# EAGLE design Arduino_S3v3_R3_ftdi (EAGLE 6.2)
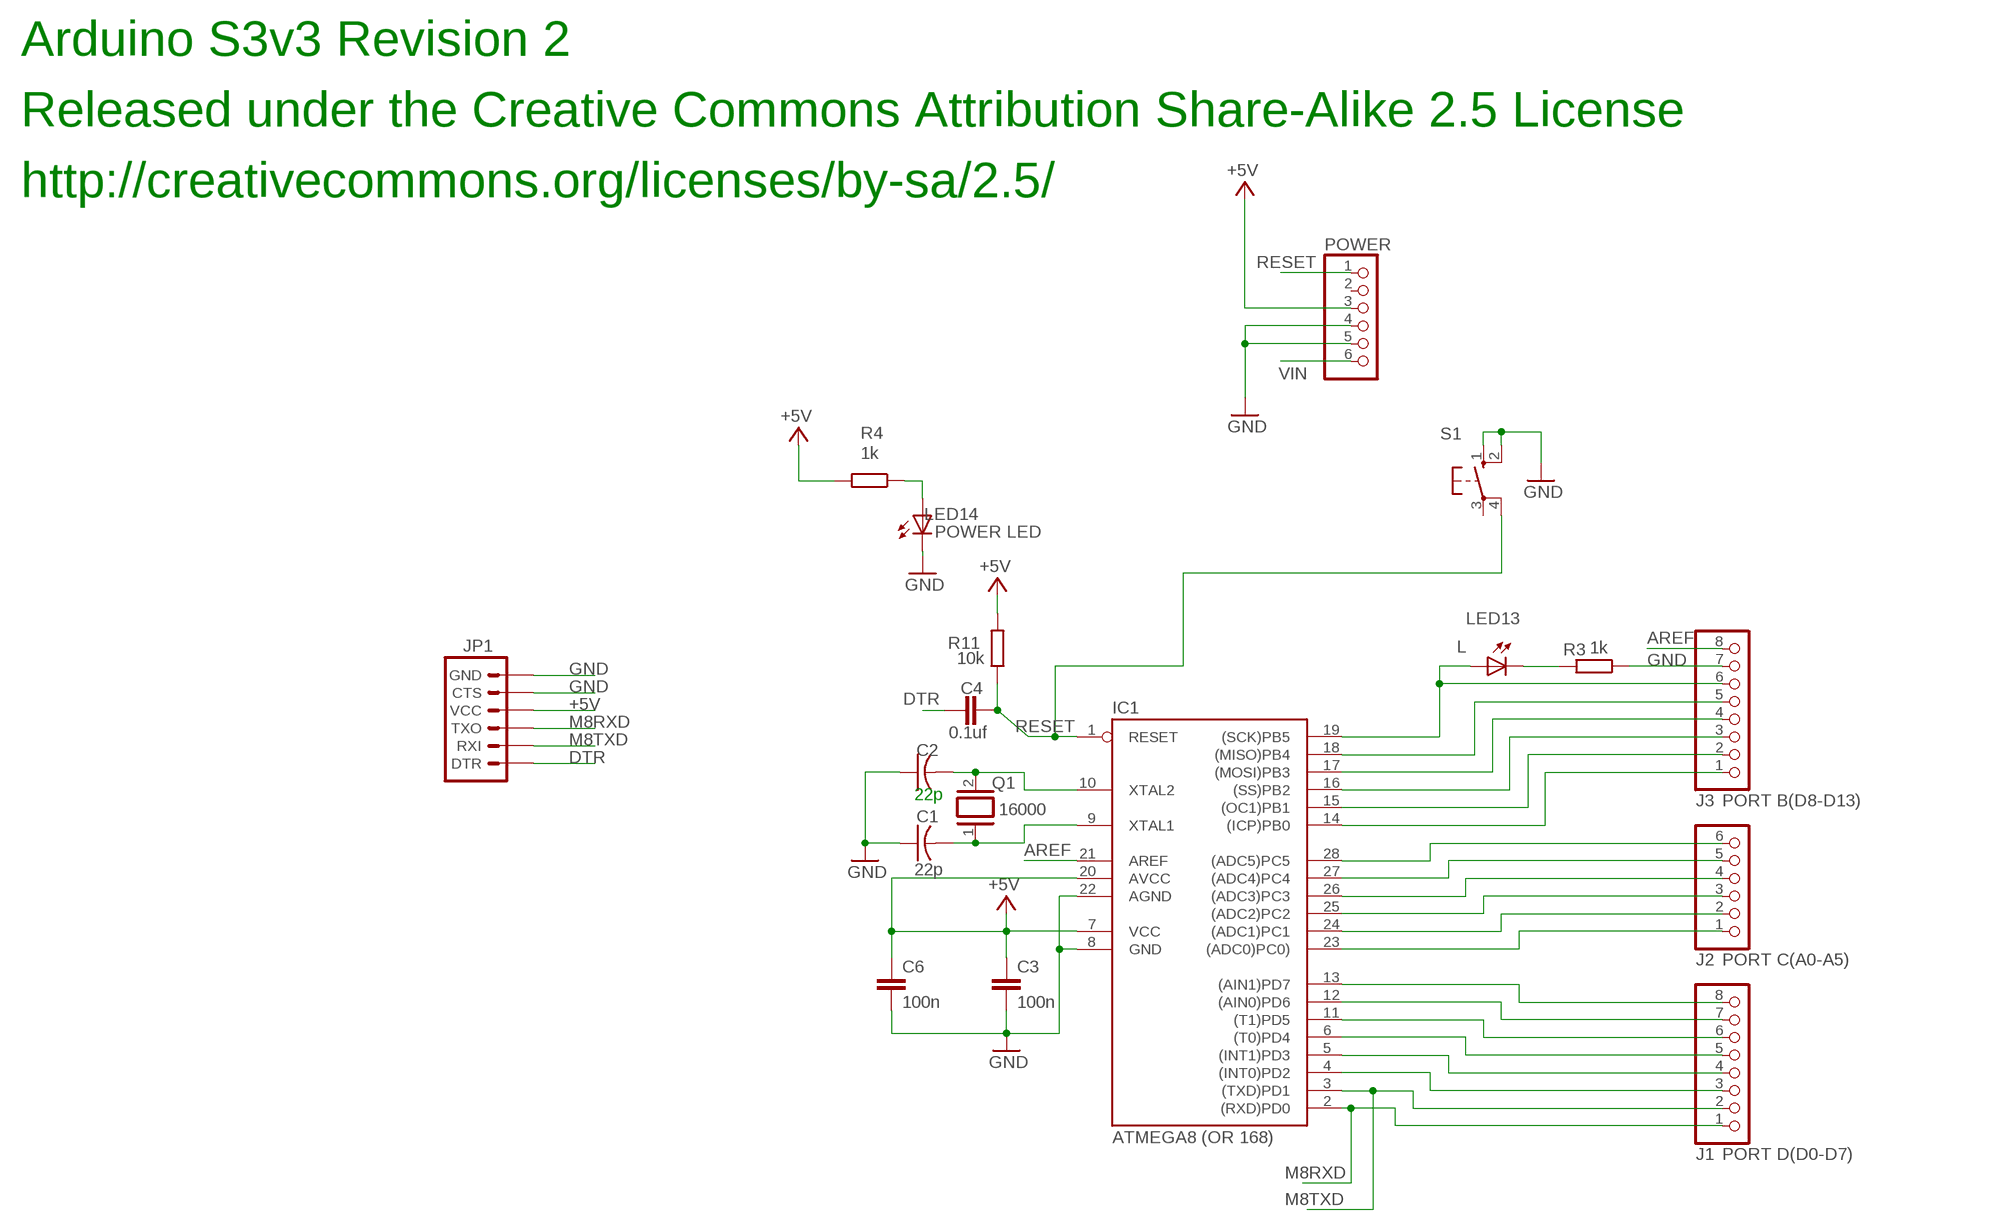
[diagram p0: schematic, sheet 1]

## Parts
C1  22p  C-US025-024X044  [C025-024X044]
C2  22p  C-US025-024X044  [C025-024X044]
C3  100n  C-EU050-025X075  [C050-025X075]
C4  0.1uf  C-EU050-025X075  [C050-025X075]
C6  100n  C-EU050-025X075  [C050-025X075]
IC1  ATMEGA8 (OR 168)  AT90S4433P  [DIL28-3]
J1  PORT D(D0-D7)  PINHD-1X8  [1X08]
J2  PORT C(A0-A5)  PINHD-1X6  [1X06]
J3  PORT B(D8-D13)  PINHD-1X8  [1X08]
JP1  ARDUINO_SERIAL_PROGRAMLONGPADS  [1X06_LONGPADS]
LED13  L  LED3MM  [LED3MM]
LED14  POWER LED  LED3MM  [LED3MM]
POWER  PINHD-1X6  [1X06]
Q1  16000  XTAL/S  [QS]
R3  1k  R-EU_0207/10  [0207/10]
R4  1k  R-EU_0207/10  [0207/10]
R11  10k  R-EU_0207/10  [0207/10]
S1  10-XX  [B3F-10XX]

## Nets
+5V [power]: C3.1 C6.1 IC1.7(VCC) IC1.20(AVCC) JP1.4(VCC) POWER.3 R4.2 R11.2
AREF: IC1.21(AREF) J3.8
DTR: C4.1 JP1.1(DTR)
GND: C1.1 C2.1 C3.2 C6.2 IC1.8(GND) IC1.22(AGND) J3.7 JP1.5(CTS) JP1.6(GND) LED14.K(C) POWER.4 POWER.5 R3.1 S1.1(S) S1.2(S1)
M8RXD: IC1.2((RXD)PD0) J1.1 JP1.3(TXO)
M8TXD: IC1.3((TXD)PD1) J1.2 JP1.2(RXI)
N$1: IC1.18((MISO)PB4) J3.5
N$3: LED14.A R4.1
N$4: IC1.17((MOSI)PB3) J3.4
N$5: IC1.14((ICP)PB0) J3.1
N$6: C1.2 IC1.9(XTAL1) Q1.1
N$7: C2.2 IC1.10(XTAL2) Q1.2
N$10: IC1.4((INT0)PD2) J1.3
N$11: IC1.5((INT1)PD3) J1.4
N$12: IC1.6((T0)PD4) J1.5
N$13: IC1.11((T1)PD5) J1.6
N$14: IC1.12((AIN0)PD6) J1.7
N$15: IC1.13((AIN1)PD7) J1.8
N$16: IC1.23((ADC0)PC0)) J2.1
N$17: IC1.24((ADC1)PC1) J2.2
N$18: IC1.25((ADC2)PC2) J2.3
N$19: IC1.26((ADC3)PC3) J2.4
N$20: IC1.27((ADC4)PC4) J2.5
N$21: IC1.28((ADC5)PC5) J2.6
N$22: IC1.15((OC1)PB1) J3.2
N$23: IC1.16((SS)PB2) J3.3
N$31: LED13.K(C) R3.2
RESET: C4.2 IC1.1(RESET) POWER.1 R11.1 S1.4(P1)
SCK: IC1.19((SCK)PB5) J3.6 LED13.A
VIN [power]: POWER.6
Unconnected: POWER.2 S1.3(P)

## Notes on the sheet
- Arduino S3v3 Revision 2
- Released under the Creative Commons Attribution Share-Alike 2.5 License
- http://creativecommons.org/licenses/by-sa/2.5/

## Library data of the parts
C1 C2 = adafruit:C-US: CAPACITOR, American symbol
C3 C4 C6 = rcl:C-EU: CAPACITOR, European symbol
IC1 = atmel:AT90S4433: MICROCONTROLLER 4 Kbytes FLASH 128 bytes SRAM 256 bytes EEPROM UART 6-channel 10 bit ADC
J1 J3 = pinhead:PINHD-1X8: PIN HEADER
J2 POWER = pinhead:PINHD-1X6: PIN HEADER
JP1 = SparkFun:ARDUINO_SERIAL_PROGRAM
LED13 LED14 = led:LED: LED OSRAM: - CHIPLED LG R971, LG N971, LY N971, LG Q971, LY Q971, LO R971, LY R971 LH N974, LH R974 LS Q976, LO Q976, LY Q976 LO Q996 - Hyper CHIPLED LW Q18S LB Q993, LB Q99A, LB R99A - SideLED LS A670, LO A670, LY A670, LG A670, LP A670 LB A673, LV A673, LT A673, LW A673 LH A674 LY A675 LS A676, LA A676, LO A676, LY A676, LW A676 LS A679, LY A679, LG A679 - Hyper Micro SIDELED® LS Y876, LA Y876, LO Y876, LY Y876 LT Y87S - SmartLED LW L88C, LW L88S LB L89C, LB L89S, LG L890 LS L89K, LO L89K, LY L89K LS L896, LA L896, LO L896, LY L896 - TOPLED LS T670, LO T670, LY T670, LG T670, LP T670 LSG T670, LSP T670, LSY T670, LOP T670, LYG T670 LG T671, LOG T671, LSG T671 LB T673, LV T673, LT T673, LW T673 LH T674 LS T676, LA T676, LO T676, LY T676, LB T676, LH T676, LSB T676, LW T676 LB T67C, LV T67C, LT T67C, LS T67K, LO T67K, LY T67K, LW E67C LS E67B, LA E67B, LO E67B, LY E67B, LB E67C, LV E67C, LT E67C LW T67C LS T679, LY T679, LG T679 LS T770, LO T770, LY T770, LG T770, LP T770 LB T773, LV T773, LT T773, LW T773 LH T774 LS E675, LA E675, LY E675, LS T675 LS T776, LA T776, LO T776, LY T776, LB T776 LHGB T686 LT T68C, LB T68C - Hyper Mini TOPLED® LB M676 - Mini TOPLED Santana® LG M470 LS M47K, LO M47K, LY M47K Source: http://www.osram.convergy.de/
Q1 = special:XTAL/S: CRYSTAL
R3 R4 R11 = rcl:R-EU_: RESISTOR, European symbol
S1 = switch-omron:10-XX: OMRON SWITCH

## Net classes
1 power: width 0.61 mm

## Board
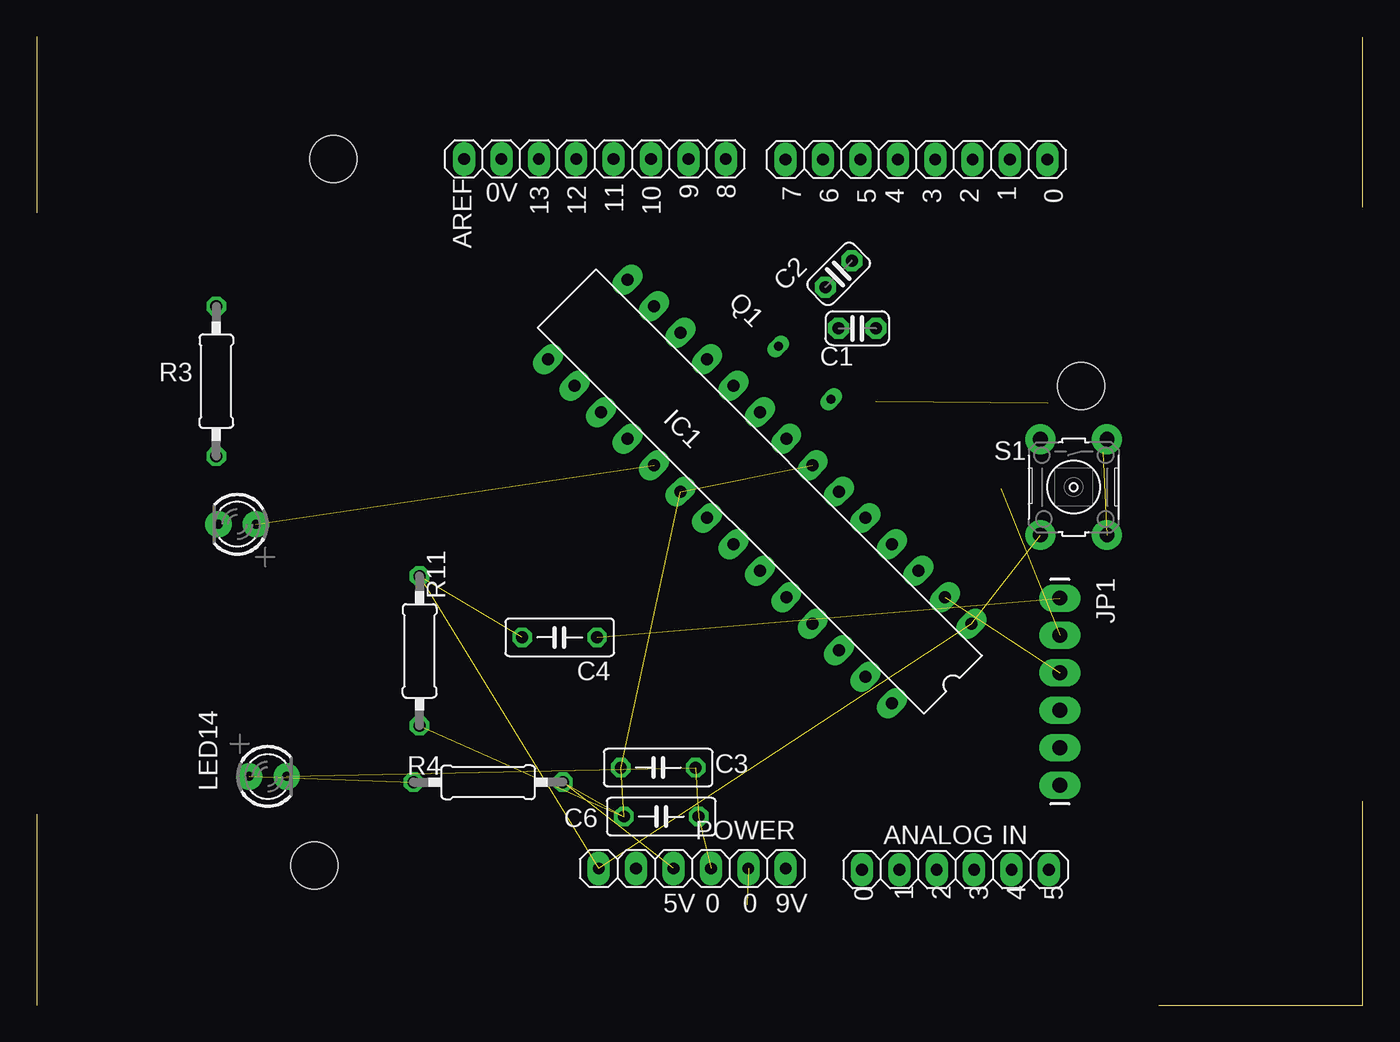
[diagram p1: board, top side]
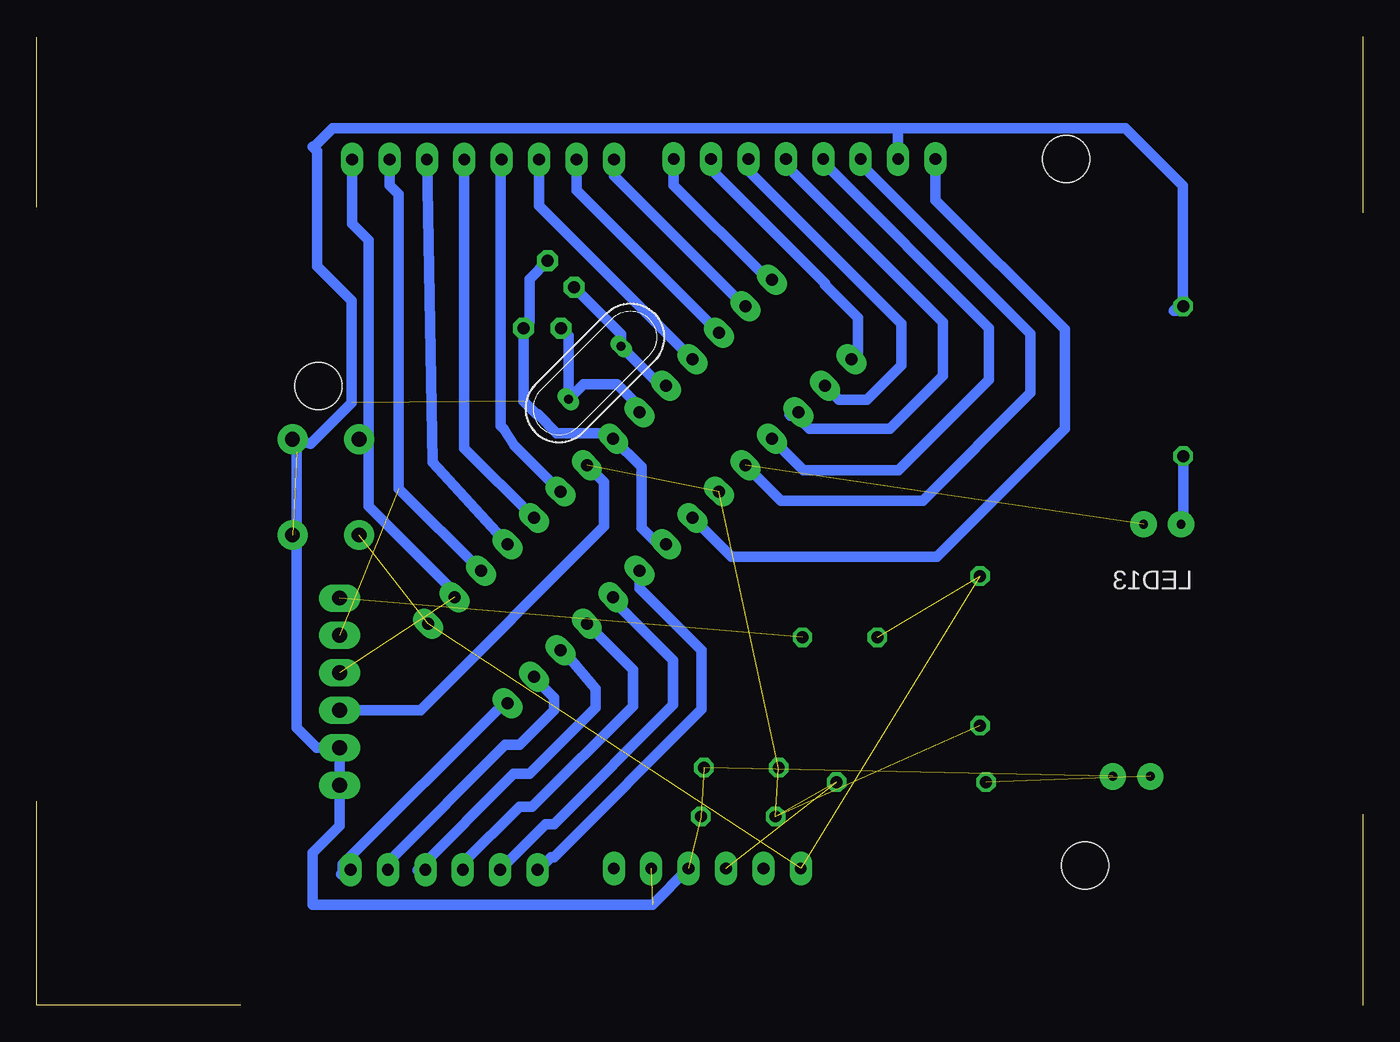
[diagram p2: board, bottom side, seen from below]

Size 90.05 x 65.74 mm. Coordinates in mm from the lower left corner, seen from the top.
Outline: 0,65.74 0,53.8
Outline: 0,12.95 0,0
Outline: 76.2,0 90.05,0
Outline: 90.05,0.01 90.05,13.85
Outline: 90.05,54.18 90.05,65.73
Copper layers (1*16): Top 0.035mm / dielectric 1.5mm / Bottom 0.035mm
Design rules: minimum track width 0.6mm, minimum drill 0.6mm, track to track 0.67mm, track to pad 0.67mm, pad to pad 0.67mm, via to via 0.67mm, smd to smd 0mil, copper to edge 0mil, drill to drill 8mil, minimum pad ring 10mil, minimum via ring 8mil, stop-mask expansion 0mil, vias tented up to drill 0mil, thermal gap 10mil
Holes 3.2 mm at 18.86,9.49 70.93,42.03 20.13,57.43

### Footprints (pad centres in the part's own frame; a part is rotated, then mirrored left to right if it is on the bottom)
C025-024X044 = drill 0.813 pad 1.422 octagon: 1 -1.27,0; 2 1.27,0
C050-025X075 = drill 0.813 octagon: 1 -2.54,0; 2 2.54,0
DIL28-3 = drill 0.813 pad 1.524 long: 1 -16.51,-3.81; 2 -13.97,-3.81; 3 -11.43,-3.81; 4 -8.89,-3.81; 5 -6.35,-3.81; 6 -3.81,-3.81; 7 -1.27,-3.81; 8 1.27,-3.81; 9 3.81,-3.81; 10 6.35,-3.81; 11 8.89,-3.81; 12 11.43,-3.81; 13 13.97,-3.81; 14 16.51,-3.81; 15 16.51,3.81; 16 13.97,3.81; 17 11.43,3.81; 18 8.89,3.81; 19 6.35,3.81; 20 3.81,3.81; 21 1.27,3.81; 22 -1.27,3.81; 23 -3.81,3.81; 24 -6.35,3.81; 25 -8.89,3.81; 26 -11.43,3.81; 27 -13.97,3.81; 28 -16.51,3.81
1X08 = drill 0.8 pad 1.524 long: 1 -8.89,0; 2 -6.35,0; 3 -3.81,0; 4 -1.27,0; 5 1.27,0; 6 3.81,0; 7 6.35,0; 8 8.89,0
1X06 = drill 0.8 pad 1.524 long: 1 -6.35,0; 2 -3.81,0; 3 -1.27,0; 4 1.27,0; 5 3.81,0; 6 6.35,0
1X06_LONGPADS = drill 1.016 pad 1.88 long: 1 0,0; 2 2.54,0; 3 5.08,0; 4 7.62,0; 5 10.16,0; 6 12.7,0
LED3MM = drill 0.6 pad 1.778: A -1.27,0; K 1.27,0
QS = drill 0.61 long: 1 -2.54,0; 2 2.54,0
0207/10 = drill 0.813 octagon: 1 -5.08,0; 2 5.08,0
B3F-10XX = drill 1 pad 2.032: 1 -3.251,2.261; 2 3.251,2.261; 3 -3.251,-2.261; 4 3.251,-2.261

### Placement (x,y rotation side)
C1  55.73,45.95 180 top
C2  54.45,49.64 225 top
C3  42.2,16.13 0 top
C4  35.51,24.97 180 top
C6  42.41,12.81 0 top
IC1  49.1,34.87 135 top
J1  59.75,57.41 180 top
J2  62.39,9.2 0 top
J3  37.91,57.45 180 top
JP1  69.49,27.64 270 top
LED13  13.61,32.64 180 top
LED14  15.69,15.53 0 top
POWER  44.51,9.28 0 top
Q1  52.16,42.93 45 bottom
R3  12.19,42.36 270 top
R4  30.66,15.13 0 top
R11  26,24.05 270 top
S1  70.42,35.17 270 top

### Tracks (layer width: path | path; a pad name or v marks a point on that pad's centre or on a via)
+5V  (6 unrouted)
  Bottom 0.7: IC1.7 51.52,35.49 51.52,32.5 64,20.02 JP1.4
AREF
  Bottom 0.7: J3.8 29.02,54.66 20.23,45.87 20.23,39.13 28.9,30.45 42.88,30.45 IC1.21
DTR  (1 unrouted)
GND  (6 unrouted)
  Bottom 0.7: 31.63,59.54 69.95,59.54 71.22,58.27 71.31,58.27 71.02,57.97 71.02,50.16 68.68,47.82 68.68,40.89 71.45,38.13 S1.1 72.39,37.54 72.39,18.83 71.03,17.48 JP1.5 JP1.6 69.49,12.17 71.31,10.34 71.31,6.83 48.23,6.83 POWER.4 | 31.63,59.54 16.13,59.54 12.23,55.63 12.23,47.72 12.82,47.14 12.49,47.14 R3.1 | J3.7 31.55,59.46 31.63,59.54 | IC1.22 47.87,31.28 48.99,32.4 48.99,36.55 IC1.8 51.28,38.84 54.74,38.84 56.01,40.11 56.11,40.11 57,41 C1.1 56.59,46.36 56.59,49.29 55.35,50.53 C2.1
M8RXD  (1 unrouted)
  Bottom 0.7: J1.1 68.64,53.05 67.51,51.92 67.51,33.86 61.68,28.03 IC1.2
M8TXD  (1 unrouted)
  Bottom 0.7: J1.2 66.1,55.68 65.47,55.05 65.47,35.07 IC1.3
N$1
  Bottom 0.7: J3.5 36.63,57.21 25.39,45.97 25.39,42.45 31.54,36.3 37.97,36.3 IC1.18
N$3  (1 unrouted)
N$4
  Bottom 0.7: J3.4 39.18,57.02 28.51,46.36 28.51,42.74 32.12,39.14 37.58,39.14 38.95,40.5 38.95,40.11 38.85,40.01 38.57,40.01 IC1.17
N$5
  Bottom 0.7: J3.1 46.8,55.67 40.7,49.58 40.46,49.58 IC1.14
N$6
  Bottom 0.7: IC1.9 49.1,40.62 50.65,42.16 52.92,42.16 Q1.1 53.95,45.45 C1.2
N$7
  Bottom 0.7: IC1.10 47.69,42.05 Q1.2 50.36,45.55 C2.2
N$10
  Bottom 0.7: J1.3 63.17,36.85 IC1.4
N$11
  Bottom 0.7: J1.4 61.02,37.8 IC1.5
N$12
  Bottom 0.7: J1.5 58.48,57.26 58.54,57.19 58.54,39.33 58.35,39.14 57.59,37.96 IC1.6
N$13
  Bottom 0.7: J1.6 55.94,54.28 IC1.11
N$14
  Bottom 0.7: J1.7 53.4,55.33 IC1.12
N$15
  Bottom 0.7: J1.8 50.86,56.32 42.45,47.92 42.4,47.92 IC1.13
N$16
  Bottom 0.7: IC1.23 49.1,28.31 44.89,24.1 44.89,20.09 54.94,10.05 55.13,10.05 56.4,8.78 56.4,8.68 56.2,8.49 56.2,9.04 J2.1
N$17
  Bottom 0.7: IC1.24 50.9,27.48 46.84,23.42 46.84,20.39 54.94,12.29 55.49,12.29 J2.2
N$18
  Bottom 0.7: J2.3 61.12,9.62 57.27,13.46 56.41,13.46 49.57,20.3 49.57,22.77 IC1.25
N$19
  Bottom 0.7: IC1.26 54.1,23.85 52.11,21.47 52.11,20.19 56.59,15.71 57.66,15.71 64.2,9.17 63.69,9.17 J2.4
N$20
  Bottom 0.7: J2.5 66.2,9.71 58.25,17.66 57.28,17.66 54.94,20 54.94,20.88 56.29,22.23 IC1.27
N$21
  Bottom 0.7: IC1.28 58.33,20.5 69.27,9.56 69.27,8.97 69.36,8.88 69.17,8.88 68.88,8.58 68.88,9.06 J2.6
N$22
  Bottom 0.7: J3.2 44.26,56.74 36.51,48.99 36.51,48.89 34.27,46.65 34.27,44.32 IC1.15
N$23
  Bottom 0.7: J3.3 41.72,56.64 31.34,46.26 31.34,43.43 33.68,41.09 35.56,41.09 IC1.16
N$31
  Bottom 0.7: R3.2 12.19,32.79 LED13.K
RESET  (4 unrouted)
SCK  (1 unrouted)
  Bottom 0.7: J3.6 34.09,57.11 22.57,45.58 22.57,41.57 29.88,34.26 39.51,34.26 IC1.19

### Text on the board
tNames: 0V | 9 | 8 | 7 | 6 | 5 | 4 | 3 | 2 | 1 | 0 | 13 | 12 | 11 | 10 | AREF | ANALOG IN | 1 | 2 | 3 | 4 | 5 | 5V | 0 | 0 | 9V | 0
bNames: LED13